# EAGLE design attiny85 (EAGLE 6.4)
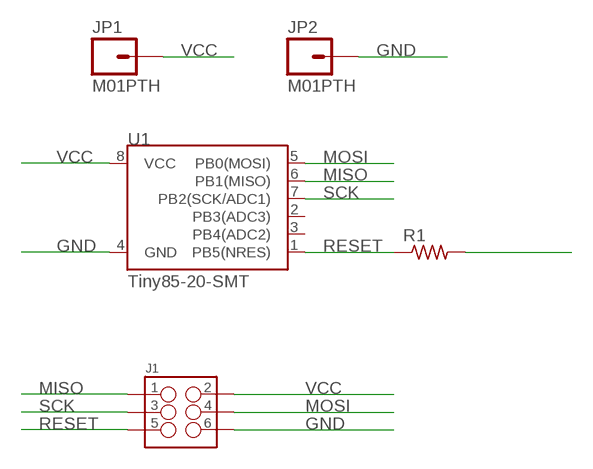
[diagram p0: schematic, sheet 1]

## Parts
J1  M03X2SMT  [2X3_SMT_POSTS]
JP1  M01PTH  [1X01]
JP2  M01PTH  [1X01]
R1  R-US_M0805  [M0805]
U1  Tiny85-20-SMT  ATTINY45TINY85-20-SMT  [SO08-EIAJ]

## Nets
GND: J1.6 JP2.1 U1.4(GND)
MISO: J1.1 U1.6(PB1(MISO))
MOSI: J1.4 U1.5(PB0(MOSI))
RESET: J1.5 R1.1 U1.1(PB5(NRES))
SCK: J1.3 U1.7(PB2(SCK/ADC1))
VCC: J1.2 JP1.1 R1.2 U1.8(VCC)
Unconnected: U1.2(PB3(ADC3)) U1.3(PB4(ADC2))

## Library data of the parts
J1 = SparkFun-Connectors:M03X2: 2x3 .1" header. Shrouded, with keying- CONN-10681 SMT- CONN-11415 Pogo pins- HW-11044; PROD_ID: CONN-11415
JP1 JP2 = SparkFun-Connectors:M01: Header 1 Standard 1-pin 0.1" header. Use with straight break away headers (SKU : PRT-00116), right angle break away headers (PRT-00553), swiss pins (PRT-00743), machine pins (PRT-00117), and female headers (PRT-00115).
R1 = adafruit:R-US_: RESISTOR, American symbol
U1 = SparkFun-DigitalIC:ATTINY45: Atmel 8-pin 2/4/8kB flash uC; PROD_ID: IC-09092

## Board
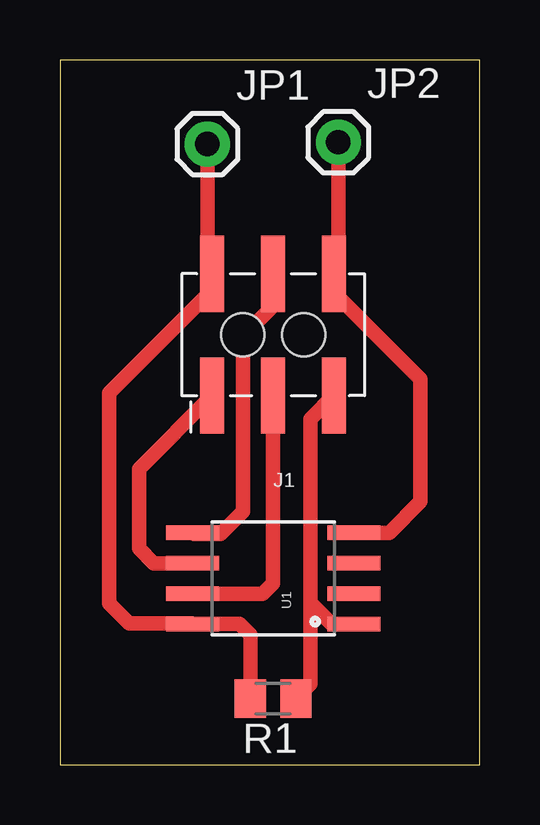
[diagram p1: board, top side]

Size 17.51 x 29.39 mm. Coordinates in mm from the lower left corner, seen from the top.
Outline: 0,0 17.51,0 17.51,29.39 0,29.39 0,0
Copper layers (1*16): Top 0.035mm / dielectric 1.5mm / Bottom 0.035mm
Design rules "default": minimum track width 10mil, minimum drill 24mil, track to track 8mil, track to pad 8mil, pad to pad 8mil, via to via 8mil, smd to smd 8mil, copper to edge 40mil, drill to drill 8mil, minimum pad ring 10mil, minimum via ring 8mil, stop-mask expansion 4mil, vias tented up to drill 0mil, thermal gap 10mil

### Footprints (pad centres in the part's own frame; a part is rotated, then mirrored left to right if it is on the bottom)
2X3_SMT_POSTS = smd 1 x 3.17: 1 -2.54,-2.54; 2 -2.54,2.54; 3 0,-2.54; 4 0,2.54; 5 2.54,-2.54; 6 2.54,2.54 | hole 1.8: -1.27,0; 1.27,0
1X01 = drill 1.016 pad 1.88: 1 0,0
M0805 = smd 1.3 x 1.6: 1 -0.95,0; 2 0.95,0
SO08-EIAJ = smd 0.61 x 2.21: 1 -1.905,-3.378; 2 -0.635,-3.378; 3 0.635,-3.378; 4 1.905,-3.378; 5 1.905,3.353; 6 0.635,3.353; 7 -0.635,3.353; 8 -1.905,3.353

### Placement (x,y rotation side)
J1  8.89,17.93 0 top
JP1  6.15,25.88 0 top
JP2  11.61,25.96 0 top
R1  8.89,2.77 180 top
U1  8.89,7.77 90 top

### Tracks (layer width: path | path; a pad name or v marks a point on that pad's centre or on a via)
GND
  Top 0.61: JP2.1 11.61,19.38 J1.6 11.43,19.68 15.04,16.08 15.04,10.97 13.74,9.68 U1.4
MISO
  Top 0.61: U1.6 3.91,8.41 3.3,9.02 3.3,12.34 J1.1
MOSI
  Top 0.61: J1.4 8.89,19.13 7.64,17.88 7.64,10.57 6.71,9.63 5.59,9.63 U1.5
RESET
  Top 0.61: J1.5 11.43,15.42 10.44,14.43 10.44,6.76 | 10.44,6.76 11.33,5.87 U1.1 | 10.44,6.76 10.44,3.37 R1.1
SCK
  Top 0.61: J1.3 8.89,7.57 8.46,7.14 U1.7
VCC
  Top 0.61: R1.2 7.95,5.41 7.49,5.87 U1.8 5.51,5.89 2.9,5.89 2.06,6.73 2.06,15.49 6.35,19.79 J1.2 6.15,19.41 JP1.1